# Altium schematic sheet PCB_BLU.SchDoc
size A4
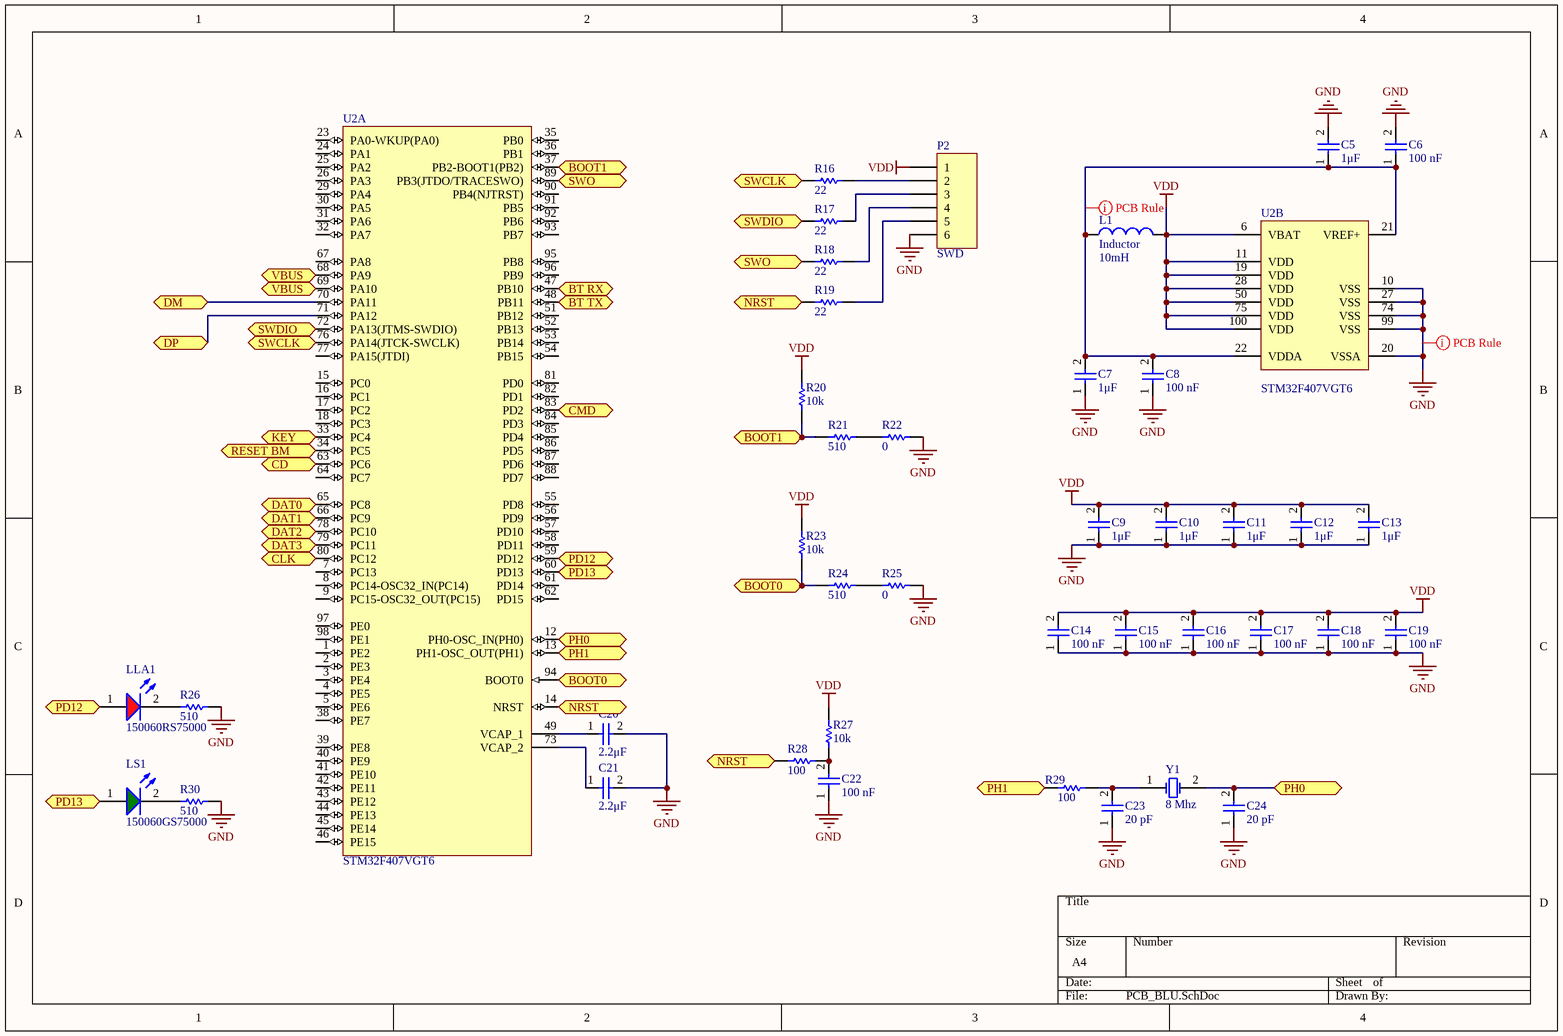
[diagram p0: PCB_BLU.SchDoc]

## Parts
C5  1μF  [WCAP-CSGP 1210, H=1.25mm]
C6  100 nF  [WCAP-CSGP 1206, H=0.8mm]
C7  1μF  [WCAP-CSGP 1210, H=1.25mm]
C8  100 nF  [WCAP-CSGP 1206, H=0.8mm]
C9  1μF  [WCAP-CSGP 1210, H=1.25mm]
C10  1μF  [WCAP-CSGP 1210, H=1.25mm]
C11  1μF  [WCAP-CSGP 1210, H=1.25mm]
C12  1μF  [WCAP-CSGP 1210, H=1.25mm]
C13  1μF  [WCAP-CSGP 1210, H=1.25mm]
C14  100 nF  [WCAP-CSGP 1206, H=0.8mm]
C15  100 nF  [WCAP-CSGP 1206, H=0.8mm]
C16  100 nF  [WCAP-CSGP 1206, H=0.8mm]
C17  100 nF  [WCAP-CSGP 1206, H=0.8mm]
C18  100 nF  [WCAP-CSGP 1206, H=0.8mm]
C19  100 nF  [WCAP-CSGP 1206, H=0.8mm]
C20  2.2μF  [WCAP-CSGP 0805, H=1.25mm]
C21  2.2μF  [WCAP-CSGP 0805, H=1.25mm]
C22  100 nF  [WCAP-CSGP 1206, H=0.8mm]
C23  20 pF  [WCAP-CSGP 0603, H=0.8mm]
C24  20 pF  [WCAP-CSGP 0603, H=0.8mm]
L1  Inductor  value 10mH  [0603]
LLA1  150060RS75000  [LED_0603_Red]
LS1  150060GS75000  [LED_0603_Green]
P2  SWD  [HDR1X6]
R16  22  [RES0402R]
R17  22  [RES0402R]
R18  22  [RES0402R]
R19  22  [RES0402R]
R20  10k  [RES0201R]
R21  510  [RES0201R]
R22  0  [RES0201R]
R23  10k  [RES0201R]
R24  510  [RES0201R]
R25  0  [RES0201R]
R26  510  [RES0402R]
R27  10k  [RES0201R]
R28  100  [RES0201R]
R29  100  [RES0402R]
R30  510  [RES0402R]
U2  STM32F407VGT6  [STM-LQFP100_N]  (parts A,B of 2)
Y1  8 Mhz  [3SMXA]

## Ports
BOOT0 (bidir), BOOT1 (bidir), BT RX (bidir), BT TX (in), CD (bidir), CLK (bidir), CMD (bidir), DAT0 (bidir), DAT1 (bidir), DAT2 (bidir), DAT3 (bidir), DM (bidir), DP (bidir), KEY (bidir), NRST (bidir), PD12 (bidir), PD13 (bidir), PH0 (bidir), PH1 (bidir), RESET BM (bidir), SWCLK (bidir), SWDIO (bidir), SWO (bidir), VBUS (bidir)

## Nets
GND: C5.2 C6.2 C7.1 C8.1 C9.1 C10.1 C11.1 C12.1 C13.1 C14.1 C15.1 C16.1 C17.1 C18.1 C19.1 C20.2 C21.2 C22.1 C23.1 C24.1 P2.6 R22.1 R25.1 R26.1 R30.1 U2.10(VSS) U2.20(VSSA) U2.27(VSS) U2.74(VSS) U2.99(VSS)
VDD: C9.2 C10.2 C11.2 C12.2 C13.2 C14.2 C15.2 C16.2 C17.2 C18.2 C19.2 L1.2 P2.1 R20.2 R23.2 R27.1 U2.6(VBAT) U2.11(VDD) U2.19(VDD) U2.28(VDD) U2.50(VDD) U2.75(VDD) U2.100(VDD)
BOOT0: R23.1 R24.2 U2.94(BOOT0) ; port BOOT0
BOOT1: R20.1 R21.2 U2.37(PB2-BOOT1(PB2)) ; port BOOT1
BT RX: U2.47(PB10) ; port BT RX
BT TX: U2.48(PB11) ; port BT TX
CD: U2.63(PC6) ; port CD
CLK: U2.80(PC12) ; port CLK
CMD: U2.83(PD2) ; port CMD
DAT0: U2.65(PC8) ; port DAT0
DAT1: U2.66(PC9) ; port DAT1
DAT2: U2.78(PC10) ; port DAT2
DAT3: U2.79(PC11) ; port DAT3
DM: U2.70(PA11) ; port DM
DP: U2.71(PA12) ; port DP
KEY: U2.33(PC4) ; port KEY
NRST: R19.2 R28.2 U2.14(NRST) ; port NRST
PD12: LLA1.1(A) U2.59(PD12) ; port PD12
PD13: LS1.1(A) U2.60(PD13) ; port PD13
PH0: C24.2 U2.12(PH0-OSC_IN(PH0)) Y1.2(OSC2) ; port PH0
PH1: R29.2 U2.13(PH1-OSC_OUT(PH1)) ; port PH1
RESET BM: U2.34(PC5) ; port RESET BM
SWCLK: R16.2 U2.76(PA14(JTCK-SWCLK)) ; port SWCLK
SWDIO: R17.2 U2.72(PA13(JTMS-SWDIO)) ; port SWDIO
SWO: R18.2 U2.89(PB3(JTDO/TRACESWO)) ; port SWO
VBUS: U2.68(PA9) U2.69(PA10) ; port VBUS
NetC5_1: C5.1 C6.1 C7.2 C8.2 L1.1 U2.21(VREF+) U2.22(VDDA)
NetC20_1: C20.1 U2.49(VCAP_1)
NetC21_1: C21.1 U2.73(VCAP_2)
NetC22_2: C22.2 R27.2 R28.1
NetC23_2: C23.2 R29.1 Y1.1(OSC1)
NetLLA1_2: LLA1.2(C) R26.2
NetLS1_2: LS1.2(C) R30.2
NetP2_2: P2.2 R16.1
NetP2_3: P2.3 R17.1
NetP2_4: P2.4 R18.1
NetP2_5: P2.5 R19.1
NetR21_1: R21.1 R22.2
NetR24_1: R24.1 R25.2

Not connected (* = marked no-connect by the designer): U2 1(PE2) 2(PE3) 3(PE4) 4(PE5) 5(PE6) 7(PC13) 8(PC14-OSC32_IN(PC14)) 9(PC15-OSC32_OUT(PC15)) 15(PC0) 16(PC1) 17(PC2) 18(PC3) 23(PA0-WKUP(PA0)) 24(PA1) 25(PA2) 26(PA3) 29(PA4) 30(PA5) 31(PA6) 32(PA7) 35(PB0) 36(PB1) 38(PE7) 39(PE8) 40(PE9) 41(PE10) 42(PE11) 43(PE12) 44(PE13) 45(PE14) 46(PE15) 51(PB12) 52(PB13) 53(PB14) 54(PB15) 55(PD8) 56(PD9) 57(PD10) 58(PD11) 61(PD14) 62(PD15) 64(PC7) 67(PA8) 77(PA15(JTDI)) 81(PD0) 82(PD1) 84(PD3) 85(PD4) 86(PD5) 87(PD6) 88(PD7) 90(PB4(NJTRST)) 91(PB5) 92(PB6) 93(PB7) 95(PB8) 96(PB9) 97(PE0) 98(PE1)

## Layout directives
rule Width Constraint [Pref Width = 0.7mm    Min Width = 0.254mm    Max Width = 0.7mm]: GND, NetC5_1

## Library data of the parts
C5 C7 C9-C13 = WCAP-CSGP 1210, 885012209011: WCAP-CSGP MLCC, X7R, 1210, 1μF pF,16Vdc; Manufacturer: Wurth Elektronik; E-mail: libraries@we-online.com; ComponentLink1Description: Manufacturer; ComponentLink1URL: http://www.we-online.com; ComponentLink2Description: Datasheet; ComponentLink2URL: http://katalog.we-online.de/pbs/datasheet/885012209011.pdf; Created by: Karrer Zheng; Created Date: 3/9/2015; Capacitance: 1μF; partNo: 885012209011
C6 C8 C14-C19 C22 = WCAP-CSGP 1206, 885012208009: WCAP-CSGP MLCC, X7R, 1206, 100000 pF,10Vdc; Manufacturer: Wurth Elektronik; E-mail: libraries@we-online.com; ComponentLink1Description: Manufacturer; ComponentLink1URL: http://www.we-online.com; ComponentLink2Description: Datasheet; ComponentLink2URL: http://katalog.we-online.de/pbs/datasheet/885012208009.pdf; Created by: Karrer Zheng; Created Date: 3/9/2015; Capacitance: 100 nF; partNo: 885012208009
C20 C21 = WCAP-CSGP 0805, 885012207024: WCAP-CSGP MLCC, X7R, 0805, 2.2μF ,10Vdc; Manufacturer: Wurth Elektronik; E-mail: libraries@we-online.com; ComponentLink1Description: Manufacturer; ComponentLink1URL: http://www.we-online.com; ComponentLink2Description: Datasheet; ComponentLink2URL: http://katalog.we-online.de/pbs/datasheet/885012207024.pdf; Created by: Karrer Zheng; Created Date: 3/9/2015; Capacitance: 2.2μF; partNo: 885012207024
C23 C24 = WCAP-CSGP 0603, 885012006004: WCAP-CSGP MLCC, NP0, 0603, 22 pF,10Vdc; Manufacturer: Wurth Elektronik; E-mail: libraries@we-online.com; ComponentLink1Description: Manufacturer; ComponentLink1URL: http://www.we-online.com; ComponentLink2Description: Datasheet; ComponentLink2URL: http://katalog.we-online.de/pbs/datasheet/885012006004.pdf; Created by: Karrer Zheng; Created Date: 3/9/2015; Capacitance: 20 pF; partNo: 885012006004
L1 = Inductor: Code_IEC: 1005; Published: 8-Jun-2000; LatestRevisionDate: 29-May-2009; LatestRevisionNote: IPC-7351 Footprint Added.; PackageReference: 0402-A; Publisher: Altium Limited; PackageDescription: Chip Inductor; Code_JEITA: 0402
LLA1 = WL-SMCW 0603  150060RS75000: SMD mono-color Chip LED, WL-SMCW, Red; Manufacturer: W黵th Elektronik eiSos GmbH; PartNo: 150060RS75000; ComponentLink1Description: Manufacturer; ComponentLink1URL: http://www.we-online.de; Created by: Christin Otto; Created Date: June 2013; ComponentLink2Description: Datasheet; ComponentLink2URL: http://katalog.we-online.com/led/datasheet/150060RS75000.pdf; Color: Red
LS1 = WL-SMCW 0603  150060GS75000: SMD mono-color Chip LED, WL-SMCW, Green; Manufacturer: W黵th Elektronik eiSos GmbH; PartNo: 150060GS75000; ComponentLink1Description: Manufacturer; ComponentLink1URL: http://www.we-online.de; Created by: Christin Otto; Created Date: June 2013; ComponentLink2Description: Datasheet; ComponentLink2URL: http://katalog.we-online.com/led/datasheet/150060GS75000.pdf; Color: Green
P2 = Header 6: Header, 6-Pin; LatestRevisionDate: 17-Jul-2002; LatestRevisionNote: Re-released for DXP Platform.; Publisher: Altium Limited
R16-R30 = Resistor1: Resistor; Value: =Value
U2 = STM32F407VGT6: ARM Cortex-M4 32-bit MCU+FPU, 210 DMIPS, 1024 kB Flash, 192 kB Internal RAM, 82 I/Os, 100-pin LQFP, -40 to 85 degC, Tray; Manufacturer: STMicroelectronics; D/A Converter: 2x12-bit; FLASH Size (Prog) (kB): 1024; I/Os (High Current): 82; Internal RAM Size (kB): 192; Operating Frequency(F) (Processor speed) (MHz): 168; Supply Voltage(Vcc) max (V): 3.6; Supply Voltage(Vcc) min (V): 1.8; DatasheetVersion: Rev. 4; PackageVersion: Rev. 1, 06/2013; PackageReference: LQFP100; PackageDescription: 100-Pin Low Profile Quad Flat Package, 14 x 14 mm Body, 0.5 mm Pitch; Supplier 1: Digi-Key; Supplier Part Number 1: 497-11605-ND; Supplier 2: Farnell; Supplier Part Number 2: 2064368; Supplier 3: Newark; Supplier Part Number 3: 73T2333; Supplier 4: Mouser; Supplier Part Number 4: 511-STM32F407VGT6; Core: ARM Cortex-M4; Packing: Tray; Mounting Technology: Surface Mount; PartNumber: STM32F407VGT6; ComponentLink1Description: Manufacturer URL; ComponentLink1URL: http://www.st.com/web/en/home.html; ComponentLink2Description: Datasheet; ComponentLink2URL: http://www.st.com/st-web-ui/static/active/en/resource/technical/document/datasheet/DM00037051.pdf; ComponentLink3Description: Package Specification; ComponentLink3URL: http://www.st.com/st-web-ui/static/active/en/resource/technical/document/data_brief/DM00071938.pdf
Y1 = XTAL: Crystal Oscillator; Published: 8-Jun-2000; LatestRevisionDate: 17-Jul-2002; LatestRevisionNote: Re-released for DXP Platform.; PackageReference: R38; Publisher: Altium Limited; PackageDescription: Crystal, Thru-Hole; 2 Leads; Body 3.1 x 8.2 mm (Dia.xH)